# EAGLE design Interconnect_board_v1p9 (EAGLE 9.3.1)
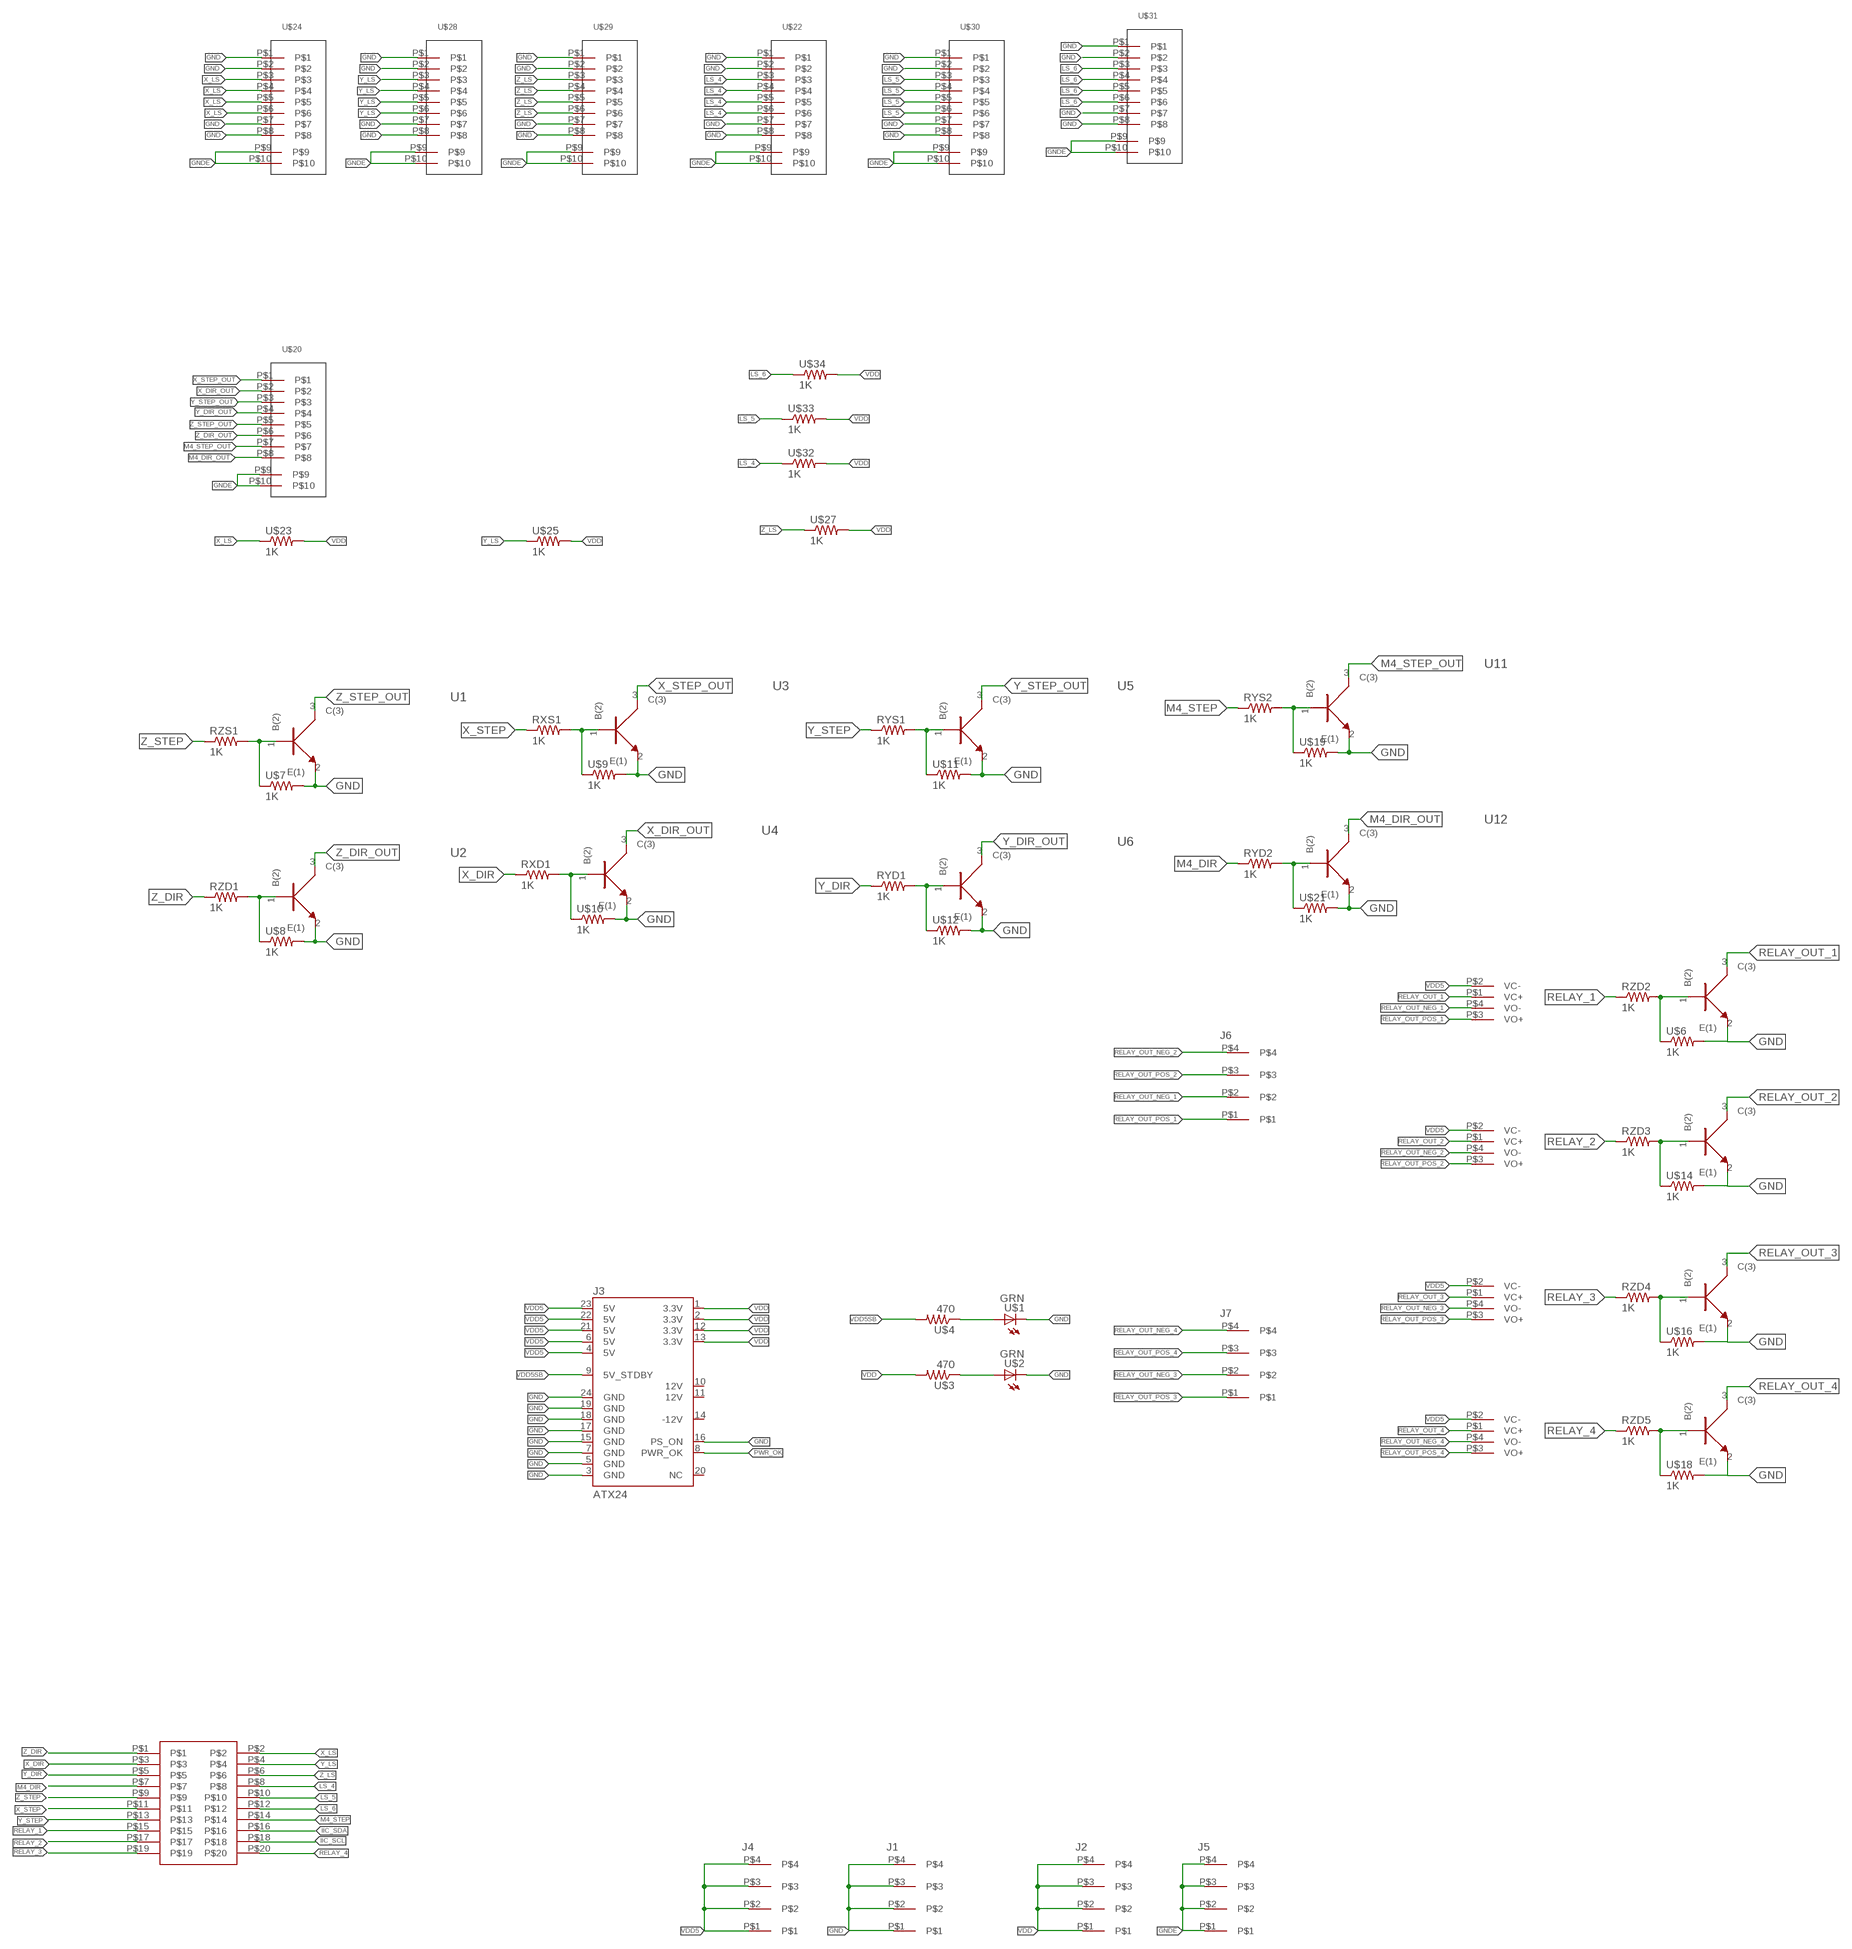
[diagram p0: schematic, sheet 1]

## Parts
J1  3.81MM_1_X_4_RT_ANGLE_PLUG_HEADER  [1X4_3.81MM_PITCH]
J2  3.81MM_1_X_4_RT_ANGLE_PLUG_HEADER  [1X4_3.81MM_PITCH]
J3  ATX24  [ATX24_STRAIGHT]
J4  3.81MM_1_X_4_RT_ANGLE_PLUG_HEADER  [1X4_3.81MM_PITCH]
J5  3.81MM_1_X_4_RT_ANGLE_PLUG_HEADER  [1X4_3.81MM_PITCH]
J6  3.81MM_1_X_4_RT_ANGLE_PLUG_HEADER  [1X4_3.81MM_PITCH]
J7  3.81MM_1_X_4_RT_ANGLE_PLUG_HEADER  [1X4_3.81MM_PITCH]
RXD1  R_0805_1K  [R_0805_1K]
RXS1  R_0805_1K  [R_0805_1K]
RYD1  R_0805_1K  [R_0805_1K]
RYD2  R_0805_1K  [R_0805_1K]
RYS1  R_0805_1K  [R_0805_1K]
RYS2  R_0805_1K  [R_0805_1K]
RZD1  R_0805_1K  [R_0805_1K]
RZD2  R_0805_1K  [R_0805_1K]
RZD3  R_0805_1K  [R_0805_1K]
RZD4  R_0805_1K  [R_0805_1K]
RZD5  R_0805_1K  [R_0805_1K]
RZS1  R_0805_1K  [R_0805_1K]
U1  BC846BW  [SOT323]
U2  BC846BW  [SOT323]
U3  BC846BW  [SOT323]
U4  BC846BW  [SOT323]
U5  BC846BW  [SOT323]
U6  BC846BW  [SOT323]
U7  BC846BW  [SOT323]
U8  BC846BW  [SOT323]
U9  BC846BW  [SOT323]
U10  BC846BW  [SOT323]
U11  BC846BW  [SOT323]
U12  BC846BW  [SOT323]
U$1  LED_0805_GREEN  [LED_0805_GREEN]
U$2  LED_0805_GREEN  [LED_0805_GREEN]
U$3  R_0805_470  [R_0805_470]
U$4  R_0805_470  [R_0805_470]
U$5  RELAY_KYOTO_KF0604D  [RELAY_KYOTO_KF0604D]
U$6  R_0805_1K  [R_0805_1K]
U$7  R_0805_1K  [R_0805_1K]
U$8  R_0805_1K  [R_0805_1K]
U$9  R_0805_1K  [R_0805_1K]
U$10  R_0805_1K  [R_0805_1K]
U$11  R_0805_1K  [R_0805_1K]
U$12  R_0805_1K  [R_0805_1K]
U$13  RELAY_KYOTO_KF0604D  [RELAY_KYOTO_KF0604D]
U$14  R_0805_1K  [R_0805_1K]
U$15  RELAY_KYOTO_KF0604D  [RELAY_KYOTO_KF0604D]
U$16  R_0805_1K  [R_0805_1K]
U$17  RELAY_KYOTO_KF0604D  [RELAY_KYOTO_KF0604D]
U$18  R_0805_1K  [R_0805_1K]
U$19  R_0805_1K  [R_0805_1K]
U$20  RJ45_SMTRJ  [RJ45_SMT]
U$21  R_0805_1K  [R_0805_1K]
U$22  RJ45_SMTRJ  [RJ45_SMT]
U$23  R_0805_1K  [R_0805_1K]
U$24  RJ45_SMTRJ  [RJ45_SMT]
U$25  R_0805_1K  [R_0805_1K]
U$26  2_X_10_HEADER_GENERIC  [2_X_10_.1_INCH]
U$27  R_0805_1K  [R_0805_1K]
U$28  RJ45_SMTRJ  [RJ45_SMT]
U$29  RJ45_SMTRJ  [RJ45_SMT]
U$30  RJ45_SMTRJ  [RJ45_SMT]
U$31  RJ45_SMTRJ  [RJ45_SMT]
U$32  R_0805_1K  [R_0805_1K]
U$33  R_0805_1K  [R_0805_1K]
U$34  R_0805_1K  [R_0805_1K]

## Nets
GND: J1.P$1 J1.P$2 J1.P$3 J1.P$4 J3.3(GND) J3.5(GND) J3.7(GND) J3.15(GND) J3.16(PS_ON) J3.17(GND) J3.18(GND) J3.19(GND) J3.24(GND) U1.2(E(1)) U2.2(E(1)) U3.2(E(1)) U4.2(E(1)) U5.2(E(1)) U6.2(E(1)) U7.2(E(1)) U8.2(E(1)) U9.2(E(1)) U10.2(E(1)) U11.2(E(1)) U12.2(E(1)) U$1.C U$2.C U$6.2 U$7.2 U$8.2 U$9.2 U$10.2 U$11.2 U$12.2 U$14.2 U$16.2 U$18.2 U$19.2 U$21.2 U$22.P$1 U$22.P$2 U$22.P$7 U$22.P$8 U$24.P$1 U$24.P$2 U$24.P$7 U$24.P$8 U$28.P$1 U$28.P$2 U$28.P$7 U$28.P$8 U$29.P$1 U$29.P$2 U$29.P$7 U$29.P$8 U$30.P$1 U$30.P$2 U$30.P$7 U$30.P$8 U$31.P$1 U$31.P$2 U$31.P$7 U$31.P$8
GNDE: J5.P$1 J5.P$2 J5.P$3 J5.P$4 U$20.P$9 U$20.P$10 U$22.P$9 U$22.P$10 U$24.P$9 U$24.P$10 U$28.P$9 U$28.P$10 U$29.P$9 U$29.P$10 U$30.P$9 U$30.P$10 U$31.P$9 U$31.P$10
IIC_SCL: U$26.P$18
IIC_SDA: U$26.P$16
LS_4: U$22.P$3 U$22.P$4 U$22.P$5 U$22.P$6 U$26.P$8 U$32.1
LS_5: U$26.P$10 U$30.P$3 U$30.P$4 U$30.P$5 U$30.P$6 U$33.1
LS_6: U$26.P$12 U$31.P$3 U$31.P$4 U$31.P$5 U$31.P$6 U$34.1
M4_DIR: RYD2.1 U$26.P$7
M4_DIR_OUT: U12.3(C(3)) U$20.P$8
M4_STEP: RYS2.1 U$26.P$14
M4_STEP_OUT: U11.3(C(3)) U$20.P$7
N$1: RXS1.2 U3.1(B(2)) U$9.1
N$2: RZD3.2 U8.1(B(2)) U$14.1
N$3: RZD1.2 U2.1(B(2)) U$8.1
N$4: U$1.A U$4.1
N$5: U$2.A U$3.1
N$6: RZD4.2 U9.1(B(2)) U$16.1
N$7: RZS1.2 U1.1(B(2)) U$7.1
N$8: RZD2.2 U7.1(B(2)) U$6.1
N$9: RYS1.2 U5.1(B(2)) U$11.1
N$10: RZD5.2 U10.1(B(2)) U$18.1
N$15: RXD1.2 U4.1(B(2)) U$10.1
N$18: RYD1.2 U6.1(B(2)) U$12.1
N$21: RYS2.2 U11.1(B(2)) U$19.1
N$22: RYD2.2 U12.1(B(2)) U$21.1
PWR_OK: J3.8(PWR_OK)
RELAY_1: RZD2.1 U$26.P$15
RELAY_2: RZD3.1 U$26.P$17
RELAY_3: RZD4.1 U$26.P$19
RELAY_4: RZD5.1 U$26.P$20
RELAY_OUT_1: U7.3(C(3)) U$5.P$1(VC+)
RELAY_OUT_2: U8.3(C(3)) U$13.P$1(VC+)
RELAY_OUT_3: U9.3(C(3)) U$15.P$1(VC+)
RELAY_OUT_4: U10.3(C(3)) U$17.P$1(VC+)
RELAY_OUT_NEG_1: J6.P$2 U$5.P$4(VO-)
RELAY_OUT_NEG_2: J6.P$4 U$13.P$4(VO-)
RELAY_OUT_NEG_3: J7.P$2 U$15.P$4(VO-)
RELAY_OUT_NEG_4: J7.P$4 U$17.P$4(VO-)
RELAY_OUT_POS_1: J6.P$1 U$5.P$3(VO+)
RELAY_OUT_POS_2: J6.P$3 U$13.P$3(VO+)
RELAY_OUT_POS_3: J7.P$1 U$15.P$3(VO+)
RELAY_OUT_POS_4: J7.P$3 U$17.P$3(VO+)
VDD: J2.P$1 J2.P$2 J2.P$3 J2.P$4 J3.1(3.3V) J3.2(3.3V) J3.12(3.3V) J3.13(3.3V) U$3.2 U$23.2 U$25.2 U$27.2 U$32.2 U$33.2 U$34.2
VDD5: J3.4(5V) J3.6(5V) J3.21(5V) J3.22(5V) J3.23(5V) J4.P$1 J4.P$2 J4.P$3 J4.P$4 U$5.P$2(VC-) U$13.P$2(VC-) U$15.P$2(VC-) U$17.P$2(VC-)
VDD5SB: J3.9(5V_STDBY) U$4.2
X_DIR: RXD1.1 U$26.P$3
X_DIR_OUT: U4.3(C(3)) U$20.P$2
X_LS: U$23.1 U$24.P$3 U$24.P$4 U$24.P$5 U$24.P$6 U$26.P$2
X_STEP: RXS1.1 U$26.P$11
X_STEP_OUT: U3.3(C(3)) U$20.P$1
Y_DIR: RYD1.1 U$26.P$5
Y_DIR_OUT: U6.3(C(3)) U$20.P$4
Y_LS: U$25.1 U$26.P$4 U$28.P$3 U$28.P$4 U$28.P$5 U$28.P$6
Y_STEP: RYS1.1 U$26.P$13
Y_STEP_OUT: U5.3(C(3)) U$20.P$3
Z_DIR: RZD1.1 U$26.P$1
Z_DIR_OUT: U2.3(C(3)) U$20.P$6
Z_LS: U$26.P$6 U$27.1 U$29.P$3 U$29.P$4 U$29.P$5 U$29.P$6
Z_STEP: RZS1.1 U$26.P$9
Z_STEP_OUT: U1.3(C(3)) U$20.P$5
Unconnected: J3.10(12V) J3.11(12V) J3.14(-12V) J3.20(NC)

## Library data of the parts
J1 J2 J4-J7 = 3D_MIG_Controller:3.81MM_1_X_4_RT_ANGLE_PLUG_HEADER
J3 = 3D_MIG_Controller:ATX24: ATX24 Pin Power Supply Connector - Right Angle PTH Mount This is a good connector for connecting a computer power supply to a PCB. It's massive, but provides many amps of power at 5V and 12V. SparkFun Products: SparkFun Benchtop Power Board Kit <https://www.sparkfun.com/products/12867> SparkFun Power Driver Shield Kit <https://www.sparkfun.com/products/10618>
RXD1 RXS1 RYD1 RYD2 RYS1 RYS2 RZD1-RZD5 RZS1 U$6-U$12 U$14 U$16 U$18 U$19 U$21 U$23 U$25 U$27 U$32-U$34 = 3D_MIG_Controller:R_0805_1K
U1-U12 = 3D_MIG_Controller:BC846BW; MANUFACTURER_PART_NUMBER: BC846BW; VENDOR: Nexperia
U$1 U$2 = 3D_MIG_Controller:LED_0805_GREEN
U$3 U$4 = 3D_MIG_Controller:R_0805_470
U$5 U$13 U$15 U$17 = 3D_MIG_Controller:RELAY_KYOTO_KF0604D
U$20 U$22 U$24 U$28-U$31 = 3D_MIG_Controller:RJ45_SMT
U$26 = 3D_MIG_Controller:2_X_10_HEADER_GENERIC

## Board
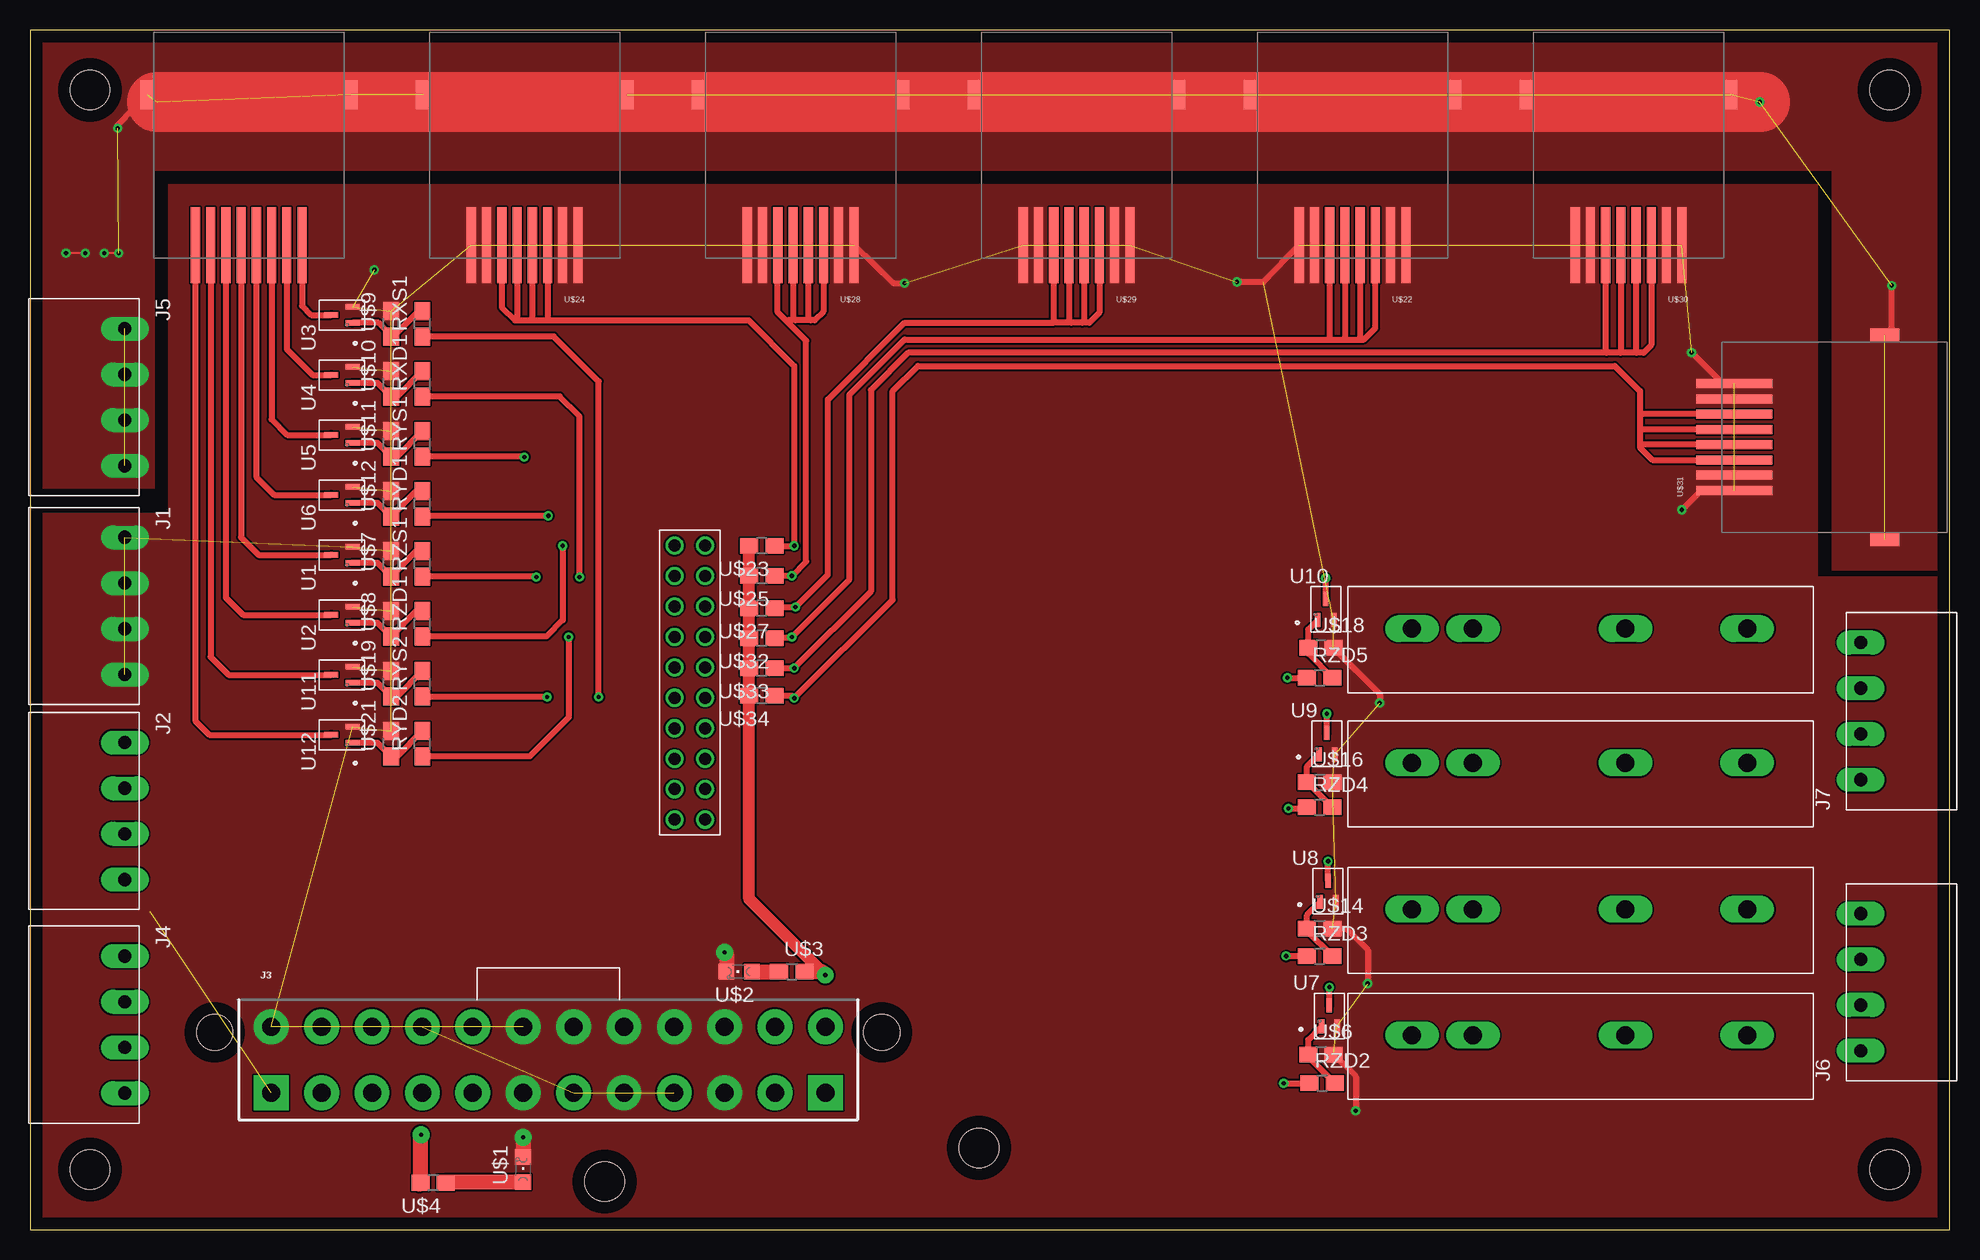
[diagram p1: board, top side]
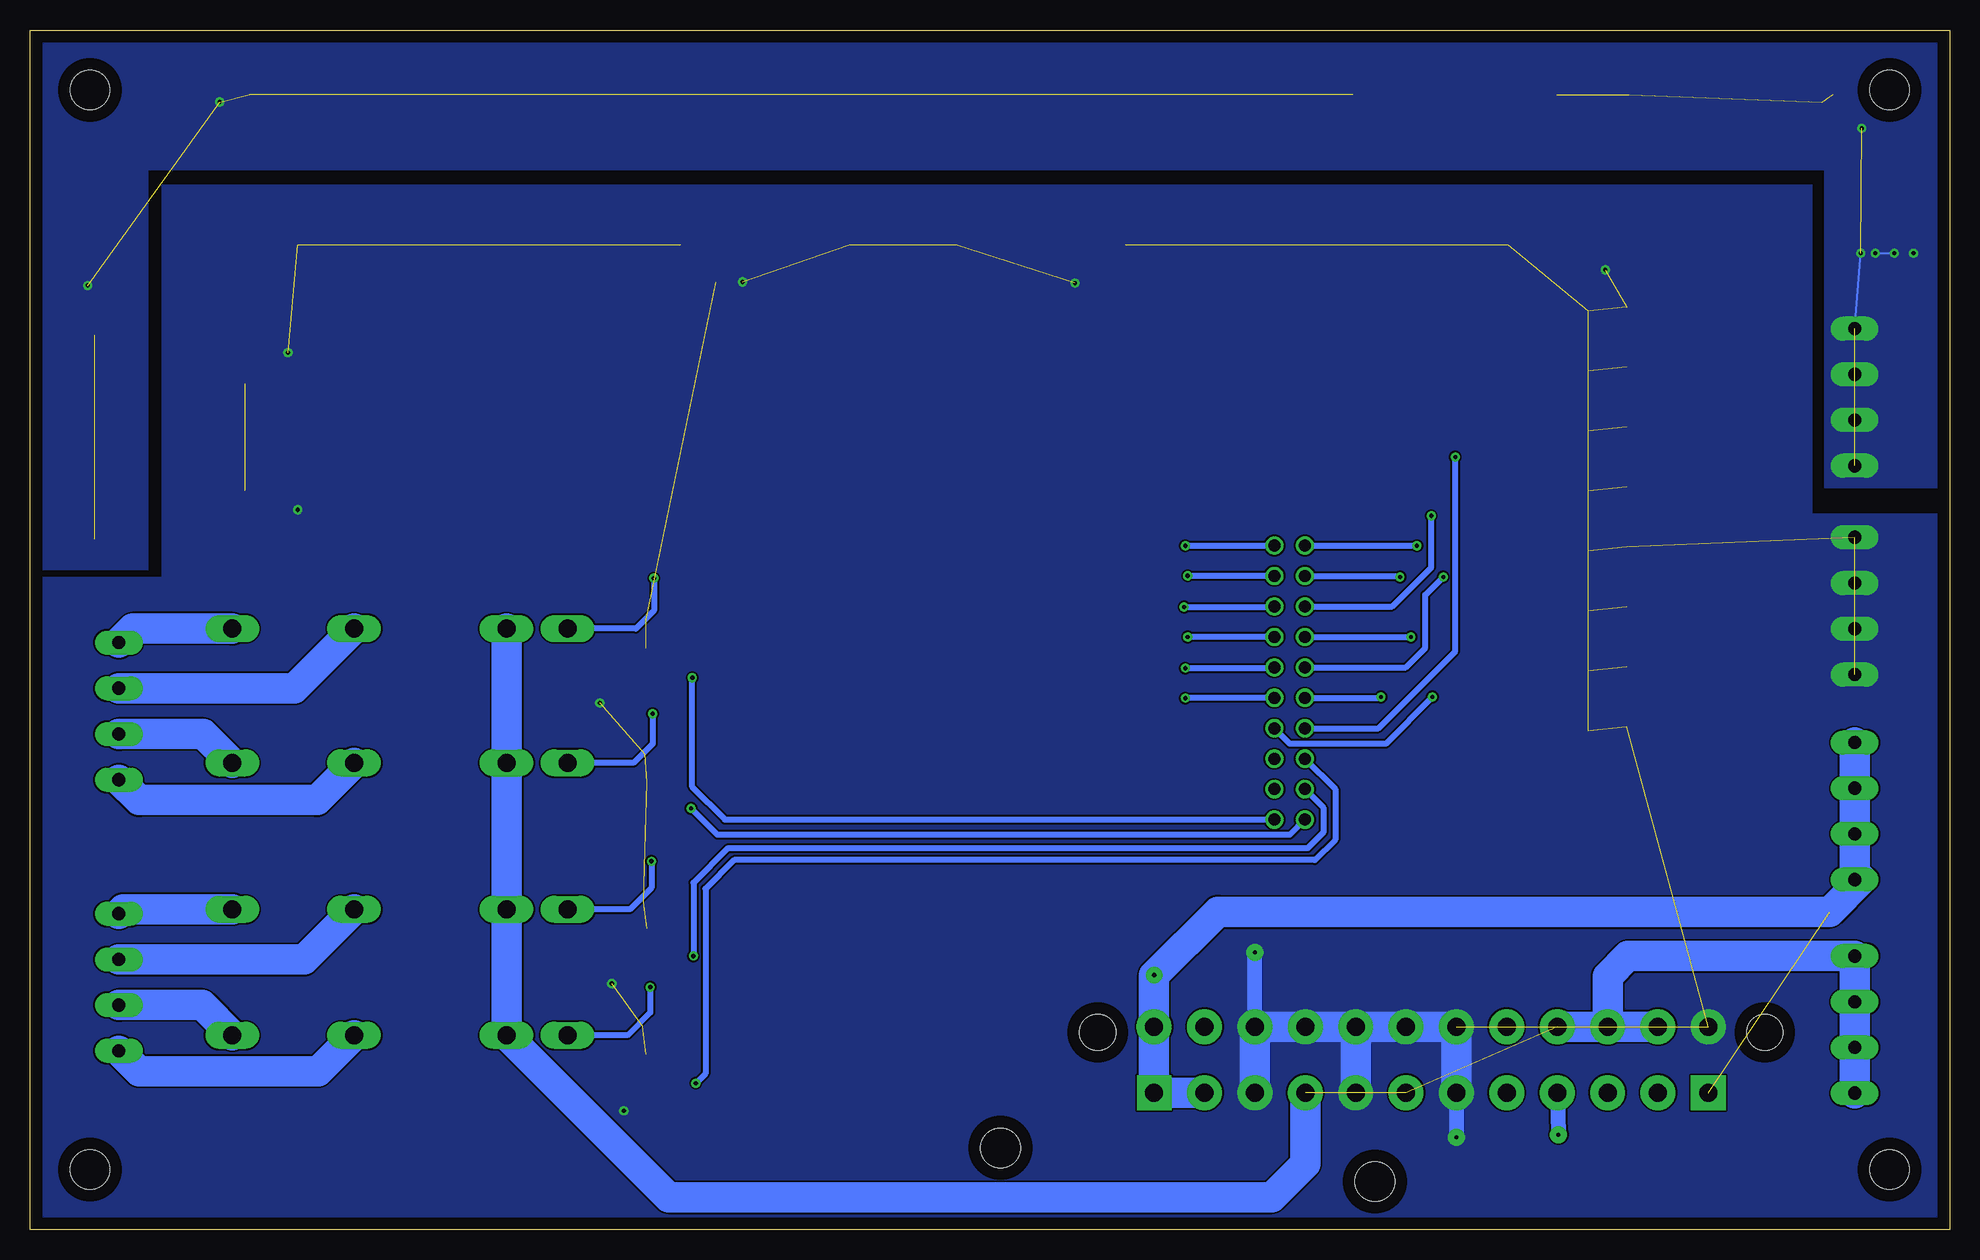
[diagram p2: board, bottom side, seen from below]

Size 160 x 100 mm. Coordinates in mm from the lower left corner, seen from the top.
Outline: 0,0 160,0 160,100 0,100 0,0
Copper layers (1*16): Top 0.035mm / dielectric 1.5mm / Bottom 0.035mm
Design rules "default": minimum track width 6mil, minimum drill 0.35mm, track to track 6mil, track to pad 6mil, pad to pad 6mil, via to via 6mil, smd to smd 6mil, copper to edge 40mil, drill to drill 6mil, minimum pad ring 10mil, minimum via ring 8mil, stop-mask expansion 4mil, vias tented up to drill 0mil, thermal gap 10mil
Holes 3.3 mm at 5,95 5,5 155,5 155,95 47.9,4 79.1,6.8

### Footprints (pad centres in the part's own frame; a part is rotated, then mirrored left to right if it is on the bottom)
1X4_3.81MM_PITCH = drill 1.1 pad 2 long: P$1 0,0; P$2 3.81,0; P$3 7.62,0; P$4 11.43,0
ATX24_STRAIGHT = drill 1.5 pad 2.9 square: 1 23.1,-5.5; 12 -23.1,-5.5 | drill 1.5 pad 2.9: 2 18.9,-5.5; 3 14.7,-5.5; 4 10.5,-5.5; 5 6.3,-5.5; 6 2.1,-5.5; 7 -2.1,-5.5; 8 -6.3,-5.5; 9 -10.5,-5.5; 10 -14.7,-5.5; 11 -18.9,-5.5; 13 23.1,0; 14 18.9,0; 15 14.7,0; 16 10.5,0; 17 6.3,0; 18 2.1,0; 19 -2.1,0; 20 -6.3,0; 21 -10.5,0; 22 -14.7,0; 23 -18.9,0; 24 -23.1,0 | hole 3: -27.8,-0.46; 27.8,-0.46
R_0805_1K = smd 1.5 x 1.3: 1 -1.052,0; 2 1.052,0
SOT323 = smd 0.457 x 1.168: 1 -0.65,-0.876; 2 0.65,-0.876; 3 0,0.876
LED_0805_GREEN = smd 1.3 x 1.3: A 0,-1.05; C 0,1.05
R_0805_470 = smd 1.5 x 1.3: 1 -1.052,0; 2 1.052,0
RELAY_KYOTO_KF0604D = drill 1.5 long: P$1 0,0; P$2 -5.08,0; P$3 -17.78,0; P$4 -27.94,0
RJ45_SMT = smd 0.76 x 6.35: P$1 -3.18,8.94; P$2 -1.91,8.94; P$3 -0.64,8.94; P$4 0.63,8.94; P$5 1.9,8.94; P$6 3.17,8.94; P$7 4.44,8.94; P$8 5.71,8.94 | smd 1.1 x 2.4: P$9 -7.25,-3.6; P$10 9.75,-3.6
2_X_10_.1_INCH = drill 1: P$1 -11.43,-1.27; P$2 -11.43,1.27; P$3 -8.89,-1.27; P$4 -8.89,1.27; P$5 -6.35,-1.27; P$6 -6.35,1.27; P$7 -3.81,-1.27; P$8 -3.81,1.27; P$9 -1.27,-1.27; P$10 -1.27,1.27; P$11 1.27,-1.27; P$12 1.27,1.27; P$13 3.81,-1.27; P$14 3.81,1.27; P$15 6.35,-1.27; P$16 6.35,1.27; P$17 8.89,-1.27; P$18 8.89,1.27; P$19 11.43,-1.27; P$20 11.43,1.27

### Placement (x,y rotation side)
J1  7.9,57.7 270 top
J2  7.9,40.6 270 top
J3  43.2,16.9 0 top
J4  7.9,22.8 270 top
J5  7.9,75.1 270 top
J6  152.6,14.9 90 top
J7  152.6,37.5 90 top
RXD1  32.7,70.5 90 top
RXS1  32.7,75.5 90 top
RYD1  32.7,60.5 90 top
RYD2  32.7,40.5 90 top
RYS1  32.7,65.5 90 top
RYS2  32.7,45.5 90 top
RZD1  32.7,50.5 90 top
RZD2  107.7,12.2 0 top
RZD3  107.5,22.8 0 top
RZD4  107.5,35.2 0 top
RZD5  107.5,46 0 top
RZS1  32.7,55.5 90 top
U1  26,56.25 90 top
U2  26,51.25 90 top
U3  26,76.25 90 top
U4  26,71.25 90 top
U5  26,66.25 90 top
U6  26,61.25 90 top
U7  108.3,17.8 0 top
U8  108.2,28.2 0 top
U9  108.1,40.5 0 top
U10  108,51.7 0 top
U11  26,46.25 90 top
U12  26,41.25 90 top
U$1  41.1,5 0 top
U$2  59.1,21.5 90 top
U$3  63.5,21.5 0 top
U$4  33.6,3.9 180 top
U$5  115.2,16.2 180 top
U$6  107.6,14.6 0 top
U$7  30.1,55.5 90 top
U$8  30.1,50.5 90 top
U$9  30.1,75.5 90 top
U$10  30.1,70.5 90 top
U$11  30.1,65.5 90 top
U$12  30.1,60.5 90 top
U$13  115.2,26.7 180 top
U$14  107.5,25.1 0 top
U$15  115.2,38.9 180 top
U$16  107.5,37.3 0 top
U$17  115.2,50.1 180 top
U$18  107.6,48.5 0 top
U$19  30.1,45.5 90 top
U$20  19.5,91 180 top
U$21  30.1,40.5 90 top
U$22  111.5,91 180 top
U$23  61,57 180 top
U$24  42.5,91 180 top
U$25  61,54.5 180 top
U$26  55,45.6 270 top
U$27  61,51.8 180 top
U$28  65.5,91 180 top
U$29  88.5,91 180 top
U$30  134.5,91 180 top
U$31  151,64.8 90 top
U$32  61,49.3 180 top
U$33  61,46.8 180 top
U$34  61,44.5 180 top

### Tracks (layer width: path | path; a pad name or v marks a point on that pad's centre or on a via)
GND  (via drill 0.35, 0.35 pad 1.4)  (54 unrouted)
  Top 0.508: U$18.2 112.5,44.65 v112.5,43.9 | U$6.2 110.5,12.75 v110.5,9.9 | U$14.2 109.7,25.1 111.5,23.3 v111.5,20.5 | U$22.P$8 102.83,79 v100.6,79 | U$28.P$1 71.94,78.9 v72.9,78.9 | U$31.P$1 139.32,61.62 v137.7,60 | U$31.P$8 141.09,70.51 v138.5,73.1
  Top 1.27: v41.1,7.7 U$1.C | v57.9,23.1 58.05,22.95 U$2.C
  Bottom 1.27: J3.7 v41.1,7.7 | J3.15 v57.9,23.1
  Bottom 2.54: J3.3 J3.15 J3.16 J3.17 | J3.5 J3.17 | J3.7 J3.19 J3.18 J3.17
  other vias: 28.7,80
  pour Bottom (no thermals): 0,0 160,0 160,54.4 149,54.4 149,87.1 11.5,87.1 11.5,59.7 0,59.7
  pour Top (no thermals): 0,0 160,0 160,54.4 149,54.4 149,87.1 11.5,87.1 11.5,59.7 0,59.7
GNDE  (via drill 0.35)  (18 unrouted)
  Top 0.152: v7.4,81.4 v6.2,81.4 | v4.6,81.4 v3,81.4
  Top 0.508: U$31.P$10 155.2,75.15 v155.2,78.7 | U$20.P$10 7.3,92.05 v7.3,91.8
  Top 5: v144.2,94 10.6,94
  Bottom 0.152: J5.P$1 v7.4,81.4 | v6.2,81.4 v4.6,81.4
  pour Bottom (no thermals): 0,61.8 10.4,61.8 10.4,64.7 10.4,88.3 146.5,88.3 150.2,88.3 150.2,55 160,55 160,100 0,100
  pour Top (no thermals): 0,61.8 10.4,61.8 10.4,88.3 150.2,88.3 150.2,55 160,55 160,56.2 160,100 0,100
LS_4  (via drill 0.35)
  Top 0.508: U$32.1 63.4,49.3 v63.5,49.4 68.3,54.2 68.3,69.6 72.9,74.2 108.4,74.2 | U$22.P$3 112.14,75.14 111.2,74.2 110.8,74.2 | 108.4,74.2 109.5,74.2 | 109.5,74.2 110.8,74.2 | U$22.P$4 110.87,74.27 110.8,74.2 | U$22.P$5 109.6,74.3 109.5,74.2 | U$22.P$6 108.33,74.27 108.4,74.2
  Bottom 0.508: U$26.P$8 v63.49,49.41 v63.5,49.4
LS_5  (via drill 0.35)
  Top 0.508: U$33.1 v63.7,46.8 70.1,53.2 70.1,70 73.2,73.1 131.4,73.1 | U$30.P$3 135.14,73.74 134.5,73.1 133.9,73.1 | 133.9,73.1 132.6,73.1 | 132.6,73.1 131.4,73.1 | U$30.P$6 131.33,73.17 131.4,73.1 | U$30.P$4 133.87,73.13 133.9,73.1 | U$30.P$5 132.6,73.1
  Bottom 0.508: v63.7,46.8 56.34,46.8 U$26.P$10
LS_6  (via drill 0.35)
  Top 0.508: U$34.1 63.5,44.5 v63.7,44.3 71.9,52.5 71.9,69.9 74,72 132.1,72 134.2,69.9 134.2,68 | U$31.P$3 135.24,64.16 134.2,65.2 134.2,65.5 | 134.2,68 134.2,66.7 | 134.2,66.7 134.2,65.5 | U$31.P$4 134.27,65.43 134.2,65.5 | U$31.P$5 134.2,66.7 | U$31.P$6 134.23,67.97 134.2,68
  Bottom 0.508: U$26.P$12 63.67,44.33 v63.7,44.3
M4_DIR  (via drill 0.35)
  Top 0.508: v44.9,49.4 44.9,42.7 41.65,39.45 RYD2.1
  Bottom 0.508: U$26.P$7 v44.91,49.41 v44.9,49.4
M4_DIR_OUT
  Top 0.508: U$20.P$8 13.79,42.41 14.95,41.25 U12.3
M4_STEP  (via drill 0.35)
  Top 0.508: v43.1,44.4 32.75,44.4 RYS2.1
  Bottom 0.508: v43.1,44.4 47,40.5 54.98,40.5 U$26.P$14
M4_STEP_OUT
  Top 0.508: U$20.P$7 15.06,47.74 16.55,46.25 U11.3
N$1
  Top 0.508: U3.1 29.06,75.59 U$9.1 30.39,74.55 32.4,76.55 RXS1.2
N$2
  Top 0.508: RZD3.2 106.45,24.91 U$14.1 106.45,26.22 U8.1
N$3
  Top 0.508: U2.1 28.95,50.6 U$8.1 32.2,51.55 RZD1.2
N$4
  Top 1.27: U$1.A 34.7,3.95 U$4.1
N$5
  Top 1.27: U$2.A U$3.1
N$6
  Top 0.508: RZD4.2 U$16.1 106.45,38.62 U9.1
N$7
  Top 0.508: U1.1 28.95,55.6 U$7.1 32.2,56.55 RZS1.2
N$8
  Top 0.508: RZD2.2 106.55,14.4 U$6.1 106.55,15.82 U7.1
N$9
  Top 0.508: U5.1 28.95,65.6 U$11.1 30.59,64.45 RYS1.2
N$10
  Top 0.508: RZD5.2 106.55,48.01 U$18.1 106.55,50.02 U10.1
N$15
  Top 0.508: U4.1 28.95,70.6 U$10.1 30.59,69.45 RXD1.2
N$18
  Top 0.508: U6.1 28.95,60.6 U$12.1 32.2,61.55 RYD1.2
N$21
  Top 0.508: U11.1 28.95,45.6 U$19.1 30.59,44.45 RYS2.2
N$22
  Top 0.508: RYD2.2 30.59,39.45 U$21.1 28.95,40.6 U12.1
RELAY_1  (via drill 0.35)
  Top 0.508: v104.5,12.2 RZD2.1
  Bottom 0.508: U$26.P$15 51.2,36.72 51.2,32.5 52.9,30.8 101.3,30.8 103.7,28.4 103.7,13 v104.5,12.2
RELAY_2  (via drill 0.35)
  Top 0.508: v104.7,22.8 RZD3.1
  Bottom 0.508: U$26.P$17 52.2,35.18 52.2,33.1 53.5,31.8 101.8,31.8 104.7,28.9 v104.7,22.8
RELAY_3  (via drill 0.35)
  Top 0.508: v104.9,35.1 106.35,35.1 RZD4.1
  Bottom 0.508: U$26.P$19 55,32.9 102.7,32.9 v104.9,35.1
RELAY_4  (via drill 0.35)
  Top 0.508: v104.8,46 RZD5.1
  Bottom 0.508: U$26.P$20 102.07,34.17 104.8,36.9 v104.8,46
RELAY_OUT_1  (via drill 0.35)
  Top 0.508: U7.3 v108.3,20.2
  Bottom 0.508: v108.3,20.2 108.3,18.1 110.2,16.2 U$5.P$1
RELAY_OUT_2  (via drill 0.35)
  Top 0.508: U8.3 v108.2,30.7
  Bottom 0.508: v108.2,30.7 108.2,28.5 110,26.7 U$13.P$1
RELAY_OUT_3  (via drill 0.35)
  Top 0.508: U9.3 v108.1,43
  Bottom 0.508: v108.1,43 108.1,40.5 109.7,38.9 U$15.P$1
RELAY_OUT_4  (via drill 0.35)
  Top 0.508: U10.3 v108,54.3
  Bottom 0.508: v108,54.3 108,51.6 109.5,50.1 U$17.P$1
RELAY_OUT_NEG_1
  Bottom 2.54: U$5.P$4 145.65,18.71 J6.P$2
RELAY_OUT_NEG_2
  Bottom 2.54: U$13.P$4 152.23,26.7 J6.P$4
RELAY_OUT_NEG_3
  Bottom 2.54: U$15.P$4 145.55,41.31 J7.P$2
RELAY_OUT_NEG_4
  Bottom 2.54: U$17.P$4 151.43,50.1 J7.P$4
RELAY_OUT_POS_1
  Bottom 2.54: U$5.P$3 135.98,13.2 150.9,13.2 J6.P$1
RELAY_OUT_POS_2
  Bottom 2.54: J6.P$3 137.16,22.52 U$13.P$3
RELAY_OUT_POS_3
  Bottom 2.54: U$15.P$3 136.08,35.8 150.9,35.8 J7.P$1
RELAY_OUT_POS_4
  Bottom 2.54: U$17.P$3 137.96,45.12 J7.P$3
VDD  (via drill 0.35 pad 1.4)  (1 unrouted)
  Top 1.016: v66.3,21.2 59.95,27.55 U$34.2 U$33.2 U$32.2 U$27.2 U$25.2 U$23.2
  Top 1.27: v66.3,21.2 66,21.5 U$3.2
  Bottom 2.54: J3.2 J3.1 J3.13 v66.3,21.2 61,26.5 10,26.5 7.33,29.17 J2.P$4 J2.P$3 J2.P$2 J2.P$1
VDD5  (2 unrouted)
  Bottom 2.54: J3.21 J3.22 | J3.23 J3.22 | J3.22 28.5,21.1 26.8,22.8 J4.P$1 J4.P$2 J4.P$3 J4.P$4 | U$17.P$2 U$15.P$2 U$13.P$2 U$5.P$2 106.78,2.7 56.5,2.7 53.7,5.5 J3.4
VDD5SB  (via drill 0.35 pad 1.4)
  Top 1.27: 32.45,3.8 U$4.2 32.55,7.85 v32.6,7.9
  Bottom 1.27: J3.9 v32.6,7.9
X_DIR  (via drill 0.35)
  Top 0.508: v45.8,54.4 45.8,67.8 44.15,69.45 RXD1.1
  Bottom 0.508: U$26.P$3 45.89,54.49 v45.8,54.4
X_DIR_OUT
  Top 0.508: U$20.P$2 21.41,73.39 23.55,71.25 U4.3
X_LS  (via drill 0.35)
  Top 0.508: U$23.1 v63.7,57 63.7,72 59.9,75.8 43.2,75.8 | U$24.P$6 39.33,76.87 40.4,75.8 | 40.4,75.8 42,75.8 | 42,75.8 43.2,75.8 | U$24.P$3 43.14,75.86 43.2,75.8 | U$24.P$4 41.87,75.93 42,75.8 | U$24.P$5 40.6,76 40.4,75.8
  Bottom 0.508: v63.7,57 63.67,57.03 U$26.P$2
X_STEP  (via drill 0.35)
  Top 0.508: v47.4,44.4 47.4,70.7 43.65,74.45 RXS1.1
  Bottom 0.508: U$26.P$11 47.47,44.33 v47.4,44.4
X_STEP_OUT
  Top 0.508: U$20.P$1 22.68,77.02 23.45,76.25 U3.3
Y_DIR  (via drill 0.35)
  Top 0.508: v43.2,59.5 32.75,59.5 RYD1.1
  Bottom 0.508: U$26.P$5 46.45,51.95 43.2,55.2 v43.2,59.5
Y_DIR_OUT
  Top 0.508: U$20.P$4 18.87,62.73 20.35,61.25 U6.3
Y_LS  (via drill 0.35)
  Top 0.508: U$25.1 v63.5,54.5 64.7,55.7 64.7,74.1 63.1,75.7 | U$28.P$6 62.33,76.47 63.1,75.7 | U$28.P$3 66.14,76.54 65.4,75.8 65.1,75.8 | 65.1,75.8 63.8,75.8 | 63.8,75.8 63.2,75.8 63.1,75.7 | U$28.P$5 63.6,76 63.8,75.8 | U$28.P$4 64.87,76.03 65.1,75.8
  Bottom 0.508: U$26.P$4 v63.49,54.49 v63.5,54.5
Y_STEP  (via drill 0.35)
  Top 0.508: v41.2,64.4 41.15,64.45 RYS1.1
  Bottom 0.508: U$26.P$13 47.61,41.79 41.2,48.2 v41.2,64.4
Y_STEP_OUT
  Top 0.508: U$20.P$3 20.14,67.56 21.45,66.25 U5.3
Z_DIR  (via drill 0.35)
  Top 0.508: v44.4,57 44.4,50.8 43.05,49.45 RZD1.1
  Bottom 0.508: U$26.P$1 44.43,57.03 v44.4,57
Z_DIR_OUT
  Top 0.508: 16.3,81.23 U$20.P$6 16.33,52.67 17.75,51.25 U2.3
Z_LS  (via drill 0.35)
  Top 0.508: U$27.1 62.15,51.9 v63.8,51.9 66.5,54.6 66.5,69.2 72.9,75.6 85.3,75.6 | U$29.P$6 85.33,75.63 85.3,75.6 | U$29.P$3 89.14,76.44 88.3,75.6 87.7,75.6 | 87.7,75.6 86.8,75.6 | 86.8,75.6 85.3,75.6 | U$29.P$4 87.87,75.77 87.7,75.6 | U$29.P$5 86.6,75.8 86.8,75.6
  Bottom 0.508: v63.8,51.9 56.32,51.9 U$26.P$6
Z_STEP  (via drill 0.35)
  Top 0.508: v42.2,54.4 42.15,54.45 RZS1.1
  Bottom 0.508: U$26.P$9 45.33,46.87 43.7,48.5 43.7,52.9 v42.2,54.4
Z_STEP_OUT
  Top 0.508: U$20.P$5 17.6,57.7 19.05,56.25 U1.3